# Altium schematic sheet AML166.SchDoc
size A3; CheckedBy: <审核人员>; Author: 刘时杰; DocumentNumber: 7; SheetNumber: 7; SheetTotal: 8; PageSetup: Record=PageOptions|CenterHorizontal=True|CenterVertical=True|PrintScale=1.00|XCorrection=1.00|YCorrection=1.00|PrintKind=0|BorderSize=5000000|LeftOffset=0|BottomOffset=0|Orientation=2|PaperLength=1000|PaperWidth=1000|Scale=100|PaperSource=7|PrintQuality=600|MediaType=1|DitherType=10|PaperKind=A4|PrintScaleMode=1; DesignDate: 20180913; CheckDate: <审核日期>; SheetName: AML166_ADC24; SheetVersion: <图纸版本>; SheetDescription: AML166评估24位ADC性能电路; ProductName: AML166; ProductModel: AML166-Core
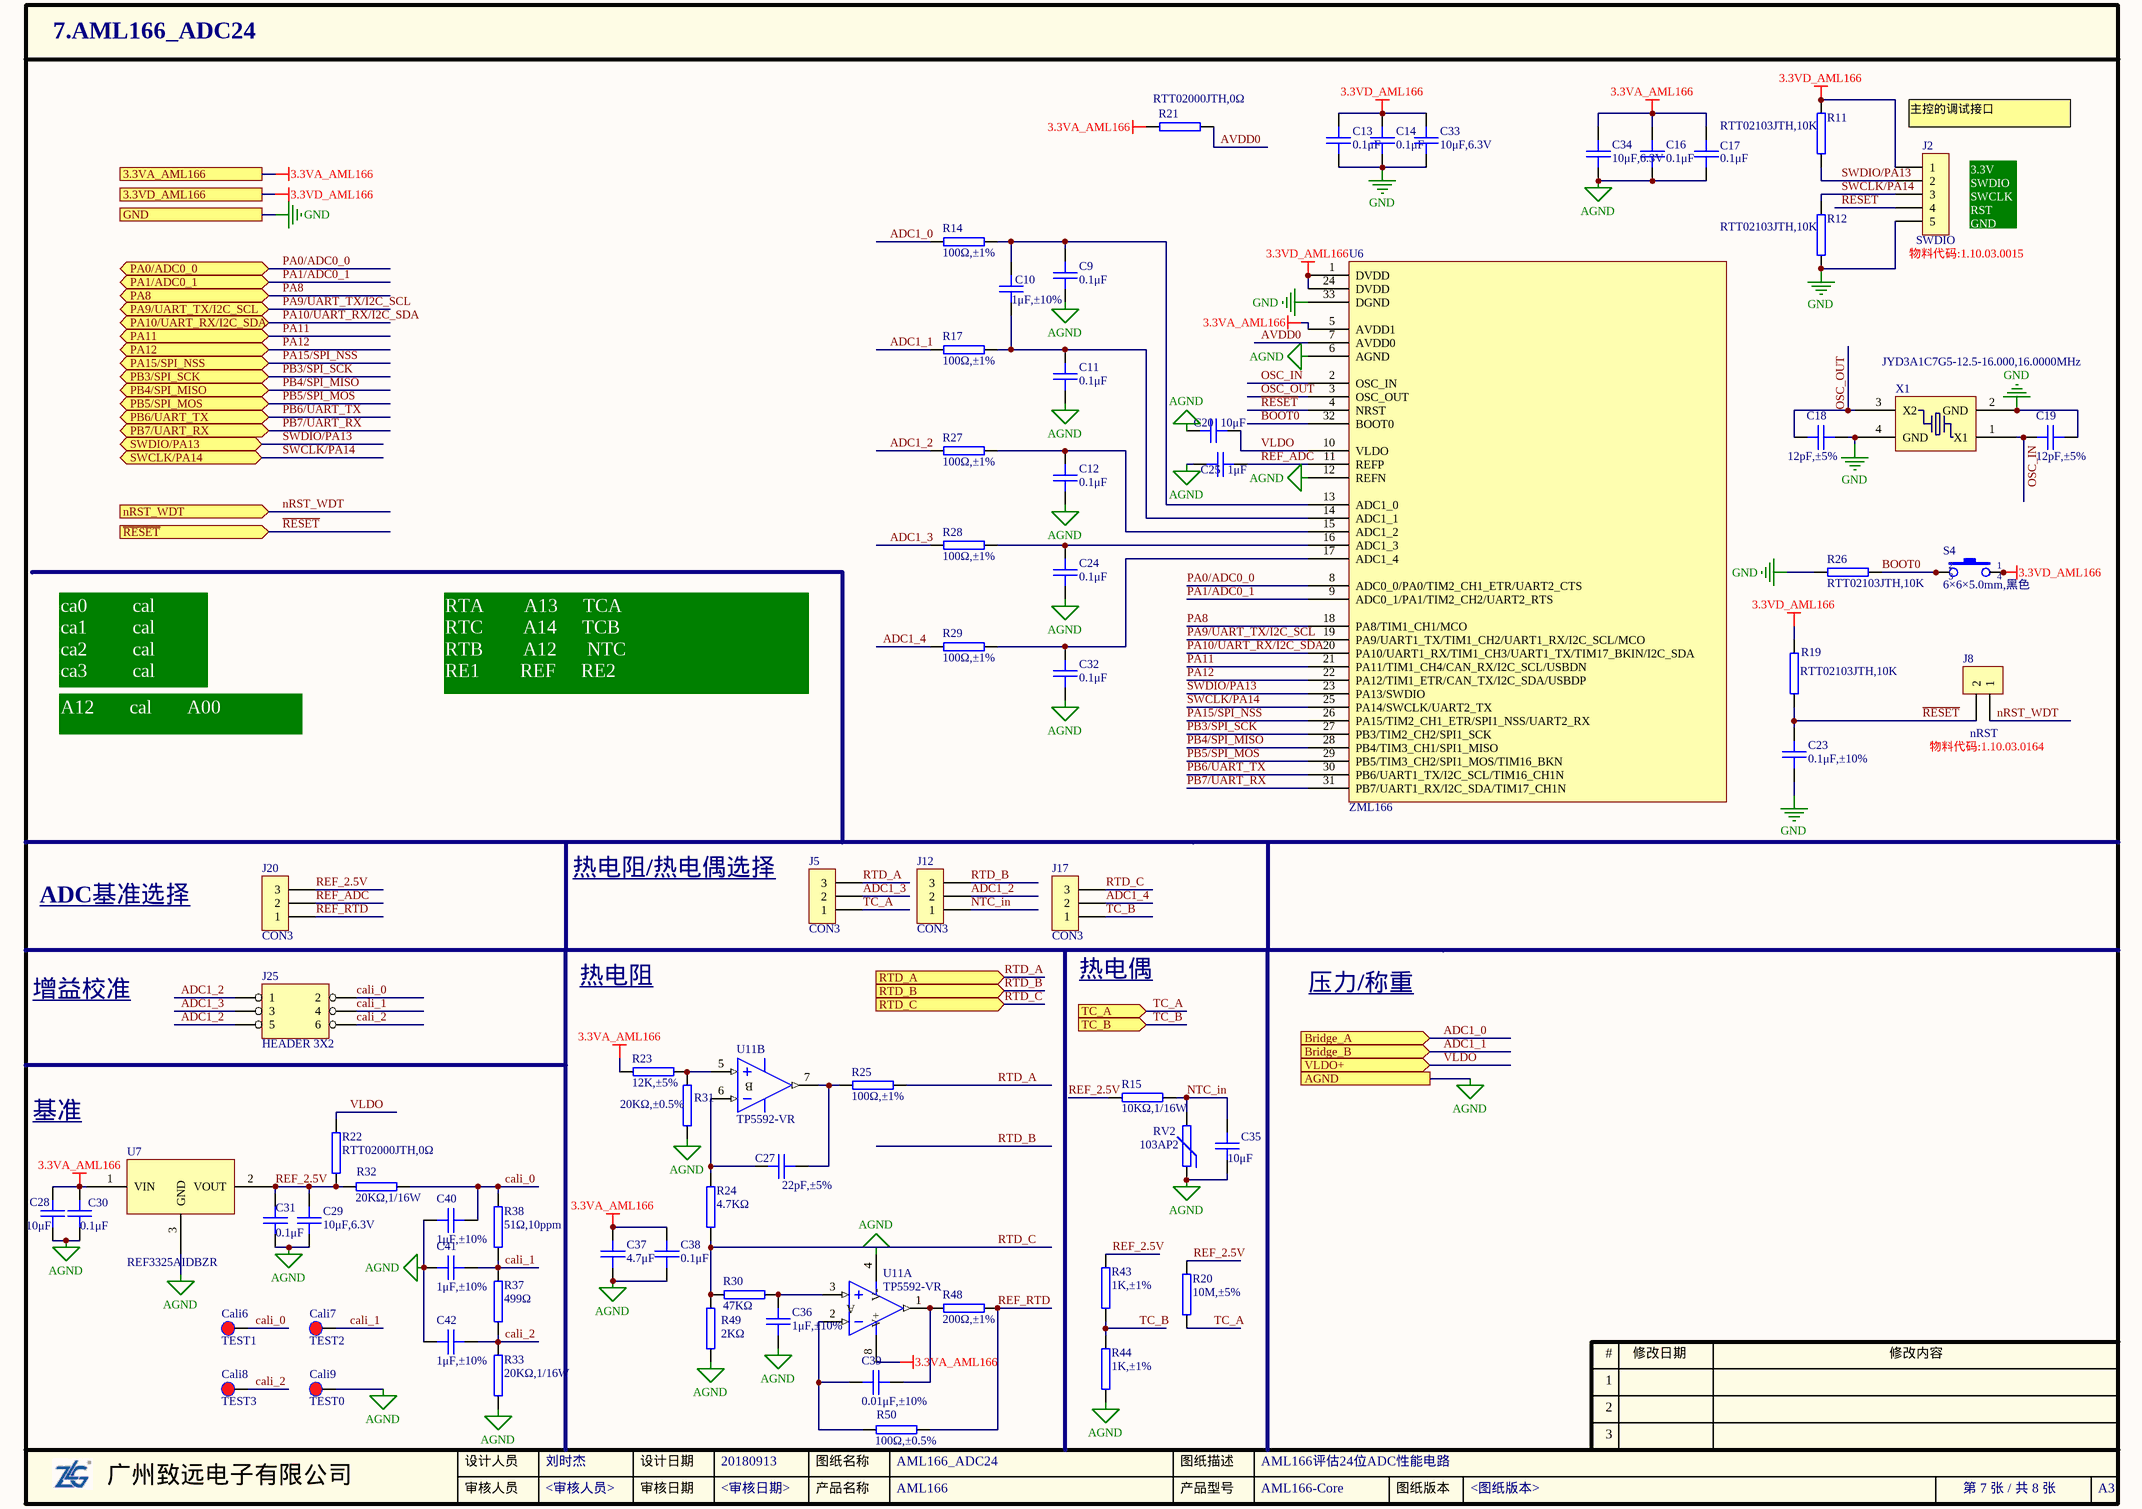
[diagram p0: AML166.SchDoc]

## Parts
C9  0.1μF  [0402C]
C10  1μF,±10%  [0402C]
C11  0.1μF  [0402C]
C12  0.1μF  [0402C]
C13  0.1μF  [0402C]
C14  0.1μF  [0402C]
C16  0.1μF  [0402C]
C17  0.1μF  [0402C]
C18  12pF,±5%  [0402C]
C19  12pF,±5%  [0402C]
C20  10μF  [0603C]
C23  0.1μF,±10%  [0402C]
C24  0.1μF  [0402C]
C25  1μF  [0402C]
C27  22pF,±5%  [0402C]
C28  10μF  [0603C]
C29  10μF,6.3V  [0603C]
C30  0.1μF  [0402C]
C31  0.1μF  [0402C]
C32  0.1μF  [0402C]
C33  10μF,6.3V  [0603C]
C34  10μF,6.3V  [0603C]
C35  10μF  [0603C]
C36  1μF,±10%  [0402C]
C37  4.7μF  [0402C]
C38  0.1μF  [0402C]
C39  0.01μF,±10%  [0402C]
C40  1μF,±10%  [0402C]
C41  1μF,±10%  [0402C]
C42  1μF,±10%  [0402C]
Cali6  TEST1  [PAD-25/40]  (no BOM)
Cali7  TEST2  [PAD-25/40]  (no BOM)
Cali8  TEST3  [PAD-25/40]  (no BOM)
Cali9  TEST0  [PAD-25/40]  (no BOM)
J2  SWDIO  [SIP-5-2.54-6.0-R90]
J5  CON3  [SIP-3-2.54]
J8  nRST  [SIP-2-2.54]
J12  CON3  [SIP-3-2.54]
J17  CON3  [SIP-3-2.54]
J20  CON3  [SIP-3-2.54]
J25  HEADER 3X2  [IDC-6-2.54]
R11  RTT02103JTH,10K  [0402R]
R12  RTT02103JTH,10K  [0402R]
R14  100Ω,±1%  [0402R]
R15  10KΩ,1/16W  [0603R]
R17  100Ω,±1%  [0402R]
R19  RTT02103JTH,10K  [0402R]
R20  10M,±5%  [0402R]
R21  RTT02000JTH,0Ω  [0402R]
R22  RTT02000JTH,0Ω  [0402R]  (no BOM)
R23  12K,±5%  [0402R]
R24  4.7KΩ  [0603R]
R25  100Ω,±1%  [0402R]
R26  RTT02103JTH,10K  [0402R]
R27  100Ω,±1%  [0402R]
R28  100Ω,±1%  [0402R]
R29  100Ω,±1%  [0402R]
R30  47KΩ  [0603R]
R31  20KΩ,±0.5%  [0402R]
R32  20KΩ,1/16W  [0603R]
R33  20KΩ,1/16W  [0603R]
R37  499Ω  [0603R]
R38  51Ω,10ppm  [0603R]
R43  1K,±1%  [0402R]
R44  1K,±1%  [0402R]
R48  200Ω,±1%  [0402R]
R49  2KΩ  [0603R]
R50  100Ω,±0.5%  [0402R]
RV2  103AP2  [RESRR254W35L380T260H850P]
S4  value 6×6×5.0mm,黑色  [KEY-6S]  (hidden comment: SW-PB4P)
U6  ZML166  [QFN50P500X500X85-33N]
U7  REF3325AIDBZR  [SOT-23]
U11  TP5592-VR  [SOP65P490X120-8N]  (parts A,B of 2)
X1  JYD3A1C7G5-12.5-16.000,16.0000MHz  [OSCCC250X320X80-4N]

## Ports
3.3VA_AML166, 3.3VD_AML166, AGND, Bridge_A (in), Bridge_B (in), GND, nRST_WDT (in), PA0/ADC0_0 (bidir), PA1/ADC0_1 (bidir), PA8 (bidir), PA9/UART_TX/I2C_SCL (bidir), PA10/UART_RX/I2C_SDA (bidir), PA11 (bidir), PA12 (bidir), PA15/SPI_NSS (bidir), PB3/SPI_SCK (bidir), PB4/SPI_MISO (bidir), PB5/SPI_MOS (bidir), PB6/UART_TX (bidir), PB7/UART_RX (bidir), RTD_A (in), RTD_B (in), RTD_C (in), SWCLK/PA14 (bidir), SWDIO/PA13 (bidir), TC_A (in), TC_B (in), VLDO+ (in), ~{RESET} (in)

## Nets
3.3VA_AML166: C16.1 C17.1 C28.2 C30.1 C34.2 C37.1 C38.1 R21.1 R23.1 U6.5(AVDD1) U7.1(VIN) U11.8(V+) ; port 3.3VA_AML166
3.3VD_AML166: C13.1 C14.1 C33.2 J2.1 R11.2 R19.1 S4.1 S4.4 U6.1(DVDD) U6.24(DVDD) ; port 3.3VD_AML166
AGND: C9.2 C11.2 C12.2 C16.2 C17.2 C20.2 C24.2 C25.1 C28.1 C29.1 C30.2 C31.2 C32.2 C34.1 C35.1 C36.2 C37.2 C38.2 C40.1 C41.1 C42.1 Cali9.1 R31.1 R33.2 R44.2 R49.1 RV2.1 U6.6(AGND) U6.12(REFN) U7.3(GND) U11.4(V-) ; port AGND
GND: C13.2 C14.2 C18.1 C19.2 C23.2 C33.1 J2.5 R12.1 R26.2 U6.33(DGND) X1.2(GND) X1.4(GND) ; port GND
ADC1_0: R14.1 ; port Bridge_A
ADC1_1: R17.1 ; port Bridge_B
ADC1_2: J12.2 J25.1 J25.5 R27.1
ADC1_3: J5.2 J25.3 R28.1
ADC1_4: J17.2 R29.1
AVDD0: R21.2 U6.7(AVDD0)
BOOT0: R26.1 S4.2 S4.3 U6.32(BOOT0)
cali_0: C40.2 Cali6.1 J25.2 R32.1 R38.1
cali_1: C41.2 Cali7.1 J25.4 R37.2 R38.2
cali_2: C42.2 Cali8.1 J25.6 R33.1 R37.1
nRST_WDT: J8.1 ; port nRST_WDT
NTC_in: C35.2 J12.1 R15.2 RV2.2
OSC_IN: C19.1 U6.2(OSC_IN) X1.1(X1)
OSC_OUT: C18.2 U6.3(OSC_OUT) X1.3(X2)
PA0/ADC0_0: U6.8(ADC0_0/PA0/TIM2_CH1_ETR/UART2_CTS) ; port PA0/ADC0_0
PA1/ADC0_1: U6.9(ADC0_1/PA1/TIM2_CH2/UART2_RTS) ; port PA1/ADC0_1
PA8: U6.18(PA8/TIM1_CH1/MCO) ; port PA8
PA9/UART_TX/I2C_SCL: U6.19(PA9/UART1_TX/TIM1_CH2/UART1_RX/I2C_SCL/MCO) ; port PA9/UART_TX/I2C_SCL
PA10/UART_RX/I2C_SDA: U6.20(PA10/UART1_RX/TIM1_CH3/UART1_TX/TIM17_BKIN/I2C_SDA) ; port PA10/UART_RX/I2C_SDA
PA11: U6.21(PA11/TIM1_CH4/CAN_RX/I2C_SCL/USBDN) ; port PA11
PA12: U6.22(PA12/TIM1_ETR/CAN_TX/I2C_SDA/USBDP) ; port PA12
PA15/SPI_NSS: U6.26(PA15/TIM2_CH1_ETR/SPI1_NSS/UART2_RX) ; port PA15/SPI_NSS
PB3/SPI_SCK: U6.27(PB3/TIM2_CH2/SPI1_SCK) ; port PB3/SPI_SCK
PB4/SPI_MISO: U6.28(PB4/TIM3_CH1/SPI1_MISO) ; port PB4/SPI_MISO
PB5/SPI_MOS: U6.29(PB5/TIM3_CH2/SPI1_MOS/TIM16_BKN) ; port PB5/SPI_MOS
PB6/UART_TX: U6.30(PB6/UART1_TX/I2C_SCL/TIM16_CH1N) ; port PB6/UART_TX
PB7/UART_RX: U6.31(PB7/UART1_RX/I2C_SDA/TIM17_CH1N) ; port PB7/UART_RX
~{RESET}: C23.1 J2.4 J8.2 R19.2 U6.4(NRST) ; port ~{RESET}
REF_2.5V: C29.2 C31.1 J20.3 R15.1 R20.2 R22.1 R32.2 R43.2 U7.2(VOUT)
REF_ADC: C25.2 J20.2 U6.11(REFP)
REF_RTD: J20.1 R48.2 R50.1
RTD_A: J5.3 R25.2 ; port RTD_A
RTD_B: J12.3 ; port RTD_B
RTD_C: J17.3 R24.1 R30.1 R49.2 ; port RTD_C
SWCLK/PA14: J2.3 R12.2 U6.25(PA14/SWCLK/UART2_TX) ; port SWCLK/PA14
SWDIO/PA13: J2.2 R11.1 U6.23(PA13/SWDIO) ; port SWDIO/PA13
TC_A: J5.1 R20.1 ; port TC_A
TC_B: J17.1 R43.1 R44.1 ; port TC_B
VLDO: C20.1 R22.2 U6.10(VLDO) ; port VLDO+
NetC9_1: C9.1 C10.1 R14.2 U6.13(ADC1_0)
NetC10_2: C10.2 C11.1 R17.2 U6.14(ADC1_1)
NetC12_1: C12.1 R27.2 U6.15(ADC1_2)
NetC24_1: C24.1 R28.2 U6.16(ADC1_3)
NetC27_1: C27.1 R24.2 U11.6(IN-)
NetC27_2: C27.2 R25.1 U11.7(OUT)
NetC32_1: C32.1 R29.2 U6.17(ADC1_4)
NetC36_1: C36.1 R30.2 U11.3(IN+)
NetC39_1: C39.1 R50.2 U11.2(IN-)
NetC39_2: C39.2 R48.1 U11.1(OUT)
NetR23_2: R23.2 R31.2 U11.5(IN+)

## Notes on the sheet
- (near J2) 主控的调试接口
- (near J2) 3.3V
  SWDIO
  SWCLK
  RST
  GND
- (near J2) 物料代码:1.10.03.0015
- ca0         cal
  ca1         cal
  ca2         cal
  ca3         cal
- RTA        A13     TCA
  RTC        A14     TCB
  RTB        A12      NTC
  RE1        REF     RE2
- A12       cal       A00
- (near J8) 物料代码:1.10.03.0164
- ADC基准选择
- 热电阻/热电偶选择
- 热电阻
- (near J17) 热电偶
- 压力/称重
- 增益校准
- 基准
- 1
- #
- 修改日期
- 修改内容
- 2
- 3
- 广州致远电子有限公司
- 设计人员
- 审核人员
- 设计日期
- 审核日期
- 产品名称
- 图纸名称
- 产品型号
- 图纸描述
- 图纸版本
- A3
- (in symbol 1.05.20.0102, part A) A
- (in symbol 1.05.20.0102, part B) B

## Library data of the parts
C9 C11-C14 C16 C17 C24 C30-C32 C38 = 1.02.17.0118: GCM155R71E104KE02D,0.1μF,±10%,25V,X7R,0402,muRata,RoHS; 名称: 电容; 封装: 0402; 贴片和直插: SMT; PCB备注: 161012yjh; 器件优选方案: 正常状态，可以选用; 物料代码: 1.02.17.0118; Value: 0.1μF; 厂商: muRata; RoHS: RoHS; 型号: GCM155R71E104KE02D,0.1μF,±10%,25V,X7R; ComponentLink1Description: ErpDataInfo; ComponentLink1URL: http://erp.zlgmcu.com/ErpExt/ErpData/ListMateriel.aspx?pkey=1.02.17.0118
C10 C25 C36 C40-C42 = 1.02.17.0092: GRM155R61C105KA12D,1μF,±10% ,16V,X5R,0402,muRata,RoHS; 名称: 电容; 封装: 0402; 贴片和直插: SMT; PCB备注: 无数据手册，依据采购部提供的信息添加的封装。; 器件优选方案: 正常状态，可以选用; 物料代码: 1.02.17.0092; 厂商: muRata; RoHS: RoHS; 型号: 1μF,±10% ,16V,X5R; ComponentLink1Description: ErpDataInfo; ComponentLink1URL: http://erp.zlgmcu.com/ErpExt/ErpData/ListMateriel.aspx?pkey=1.02.17.0092
  C10 C36 C40-C42: Value: 1μF,±10%
  C25: Value: 1μF
C18 C19 = 1.02.17.0018: GRM1555C1H120JA01D,12pF,±5%,50V,C0G,0402,muRata,RoHS; 名称: 电容; 封装: 0402; 设备封装名称: C0402_12PF_COG_50V_5%; 贴片和直插: SMT; 器件优选方案: 正常状态，可以选用; 物料代码: 1.02.17.0018; Value: 12pF,±5%; 厂商: muRata; RoHS: RoHS; 型号: 12pF,±5%,50V,C0G; ComponentLink1Description: ErpDataInfo; ComponentLink1URL: http://erp.zlgmcu.com/ErpExt/ErpData/ListMateriel.aspx?pkey=1.02.17.0018
C20 C28 C29 C33-C35 = 1.02.01.0065: 10μF,6.3V,X5R,GRM188R60J106M****,0603,Murata,RoHS; 名称: 电容; 封装: 0603; 贴片和直插: SMT; 器件优选方案: 正常状态，可以选用; 物料代码: 1.02.01.0065; 厂商: muRata; RoHS: RoHS; 型号: 10μF,6.3V,X5R,GRM188R60J106M****; ComponentLink1Description: ErpDataInfo; ComponentLink1URL: http://erp.zlgmcu.com/ErpExt/ErpData/ListMateriel.aspx?pkey=1.02.01.0065
  C20 C28 C35: Value: 10μF
  C29 C33 C34: Value: 10μF,6.3V
C23 = 1.02.17.0006: GRM155R71C104KA88D,0.1μF,±10%,16V,X7R,0402,muRata,RoHS; 名称: 电容; 封装: 0402; 设备封装名称: C0402_0.1uF_X7R_16V_10%; 贴片和直插: SMT; 器件优选方案: 正常状态，可以选用; 物料代码: 1.02.17.0006; Value: 0.1μF,±10%; 厂商: muRata; RoHS: RoHS; 型号: 0.1μF,±10%,16V,X7R; ComponentLink1Description: ErpDataInfo; ComponentLink1URL: http://erp.zlgmcu.com/ErpExt/ErpData/ListMateriel.aspx?pkey=1.02.17.0006
C27 = 1.02.17.0036: GRM1555C1H220JA01D,22pF,±5%,50V,C0G,0402,muRata,RoHS; 名称: 电容; 封装: 0402; 设备封装名称: C0402_22PF_NPO_50V_5%; 贴片和直插: SMT; 器件优选方案: 正常状态，可以选用; 物料代码: 1.02.17.0036; Value: 22pF,±5%; 厂商: muRata; RoHS: RoHS; 型号: 22pF,±5%,50V,C0G; ComponentLink1Description: ErpDataInfo; ComponentLink1URL: http://erp.zlgmcu.com/ErpExt/ErpData/ListMateriel.aspx?pkey=1.02.17.0036
C37 = 1.02.17.0073: GRM155R60J475ME87D,4.7μF,±20%,6.3V,X5R,0402,muRata,RoHS; 名称: 电容; 封装: 0402; 贴片和直插: SMT; 器件优选方案: 正常状态，可以选用; 物料代码: 1.02.17.0073; Value: 4.7μF; 厂商: muRata; RoHS: RoHS; 型号: 4.7μF,±20%,6.3V,X5R; ComponentLink1Description: ErpDataInfo; ComponentLink1URL: http://erp.zlgmcu.com/ErpExt/ErpData/ListMateriel.aspx?pkey=1.02.17.0073
C39 = 1.02.17.0019: GRM155R71H103KA88D,0.01μF,±10%,50V,X7R,0402,muRata,RoHS; 名称: 电容; 封装: 0402; 设备封装名称: C0402_0.01uF_X7R_50V_10%; 贴片和直插: SMT; 器件优选方案: 正常状态，可以选用; 物料代码: 1.02.17.0019; Value: 0.01μF,±10%; 厂商: muRata; RoHS: RoHS; 型号: 0.01μF,±10%,50V,X7R; ComponentLink1Description: ErpDataInfo; ComponentLink1URL: http://erp.zlgmcu.com/ErpExt/ErpData/ListMateriel.aspx?pkey=1.02.17.0019
Cali6-Cali9 = TEST-DOT
J2 = CON5: Connector; 物料代码: 1.10.03.0015
J5 J12 J17 J20 = CON3: Connector
J8 = CON2: Connector; 物料代码: 1.10.03.0164
R11 R12 R19 R26 = 1.01.17.0006: RTT02103JTH,10K,±5%,0402,RALEC,RoHS; 名称: 电阻; 封装: 0402; 设备封装名称: R0402_10K; 贴片和直插: SMT; 器件优选方案: 正常状态，可以选用; 物料代码: 1.01.17.0006; Value: RTT02103JTH,10K; 厂商: RALEC; RoHS: RoHS; 型号: RTT02103JTH,10K,±5%; ComponentLink1Description: ErpDataInfo; ComponentLink1URL: http://erp.zlgmcu.com/ErpExt/ErpData/ListMateriel.aspx?pkey=1.01.17.0006
R14 R17 R25 R27-R29 = 1.01.17.0029: 100Ω,±1%,0402,RALEC,RoHS; 名称: 电阻; 封装: 0402; 设备封装名称: R0402_100R_1%; 贴片和直插: SMT; 器件优选方案: 正常状态，可以选用; 物料代码: 1.01.17.0029; Value: 100Ω,±1%; 厂商: Ralec; RoHS: RoHS; 型号: 100Ω,±1%; ComponentLink1Description: ErpDataInfo; ComponentLink1URL: http://erp.zlgmcu.com/ErpExt/ErpData/ListMateriel.aspx?pkey=1.01.17.0029
R15 = 1.01.01.0192: 10KΩ,1/16W,10PPM/℃,±0.1%,0603,Viking,RoHS; 名称: 电阻; 封装: 0603; 设备封装名称: R0603_10K_0.1%; 贴片和直插: SMT; 器件优选方案: 临时/偏门物料/不主推物料，谨慎选用; 物料代码: 1.01.01.0192; Value: 10KΩ,1/16W; 厂商: Viking; RoHS: RoHS; 型号: 10KΩ,1/16W,10PPM/℃,±0.1%; ComponentLink1Description: ErpDataInfo; ComponentLink1URL: http://erp.zlgmcu.com/ErpExt/ErpData/ListMateriel.aspx?pkey=1.01.01.0192
R20 = 1.01.17.0005: 10M,±5%,0402,RALEC,RoHS; 名称: 电阻; 封装: 0402; 设备封装名称: R0402_10M; 贴片和直插: SMT; 器件优选方案: 正常状态，可以选用; 物料代码: 1.01.17.0005; Value: 10M,±5%; 厂商: Ralec; RoHS: RoHS; 型号: 10M,±5%; ComponentLink1Description: ErpDataInfo; ComponentLink1URL: http://erp.zlgmcu.com/ErpExt/ErpData/ListMateriel.aspx?pkey=1.01.17.0005
R21 R22 = 1.01.17.0004: RTT02000JTH,0Ω,±5%,0402,RALEC,RoHS; 名称: 电阻; 封装: 0402; 设备封装名称: R0402_0R; 贴片和直插: SMT; 器件优选方案: 正常状态，可以选用; 物料代码: 1.01.17.0004; Value: RTT02000JTH,0Ω; 厂商: RALEC; RoHS: RoHS; 型号: RTT02000JTH,0Ω,±5%; ComponentLink1Description: ErpDataInfo; ComponentLink1URL: http://erp.zlgmcu.com/ErpExt/ErpData/ListMateriel.aspx?pkey=1.01.17.0004
R23 = 1.01.17.0035: 12K,±5%,0402,RALEC,RoHS; 名称: 电阻; 封装: 0402; 设备封装名称: R0402_12K; 贴片和直插: SMT; 器件优选方案: 正常状态，可以选用; 物料代码: 1.01.17.0035; Value: 12K,±5%; 厂商: Ralec; RoHS: RoHS; 型号: 12K,±5%; ComponentLink1Description: ErpDataInfo; ComponentLink1URL: http://erp.zlgmcu.com/ErpExt/ErpData/ListMateriel.aspx?pkey=1.01.17.0035
R24 = 1.01.01.0045: 4.7KΩ,0603,*,RoHS; 名称: 电阻; 封装: 0603; 设备封装名称: R0603_4.7K; 厂商: Ralec; 贴片和直插: SMT; 器件优选方案: 正常状态，可以选用; 物料代码: 1.01.01.0045; Value: 4.7KΩ; RoHS: RoHS; 型号: 4.7KΩ; ComponentLink1Description: ErpDataInfo; ComponentLink1URL: http://erp.zlgmcu.com/ErpExt/ErpData/ListMateriel.aspx?pkey=1.01.01.0045
R30 = 1.01.01.0060: 47KΩ,0603,*,RoHS; 名称: 电阻; 封装: 0603; 设备封装名称: R0603_47K; 厂商: Ralec; 贴片和直插: SMT; 器件优选方案: 正常状态，可以选用; 物料代码: 1.01.01.0060; Value: 47KΩ; RoHS: RoHS; 型号: 47KΩ; ComponentLink1Description: ErpDataInfo; ComponentLink1URL: http://erp.zlgmcu.com/ErpExt/ErpData/ListMateriel.aspx?pkey=1.01.01.0060
R31 = 1.01.17.0053: 20KΩ,±0.5%,0402,RoHS; 名称: 电阻; 封装: 0402; 设备封装名称: R0402_20K_0.5%; 厂商: Ralec; 贴片和直插: SMT; 器件优选方案: 正常状态，可以选用; 物料代码: 1.01.17.0053; Value: 20KΩ,±0.5%; RoHS: RoHS; 型号: 20KΩ,±0.5%; ComponentLink1Description: ErpDataInfo; ComponentLink1URL: http://erp.zlgmcu.com/ErpExt/ErpData/ListMateriel.aspx?pkey=1.01.17.0053
R32 R33 = 1.01.01.0207: 20KΩ,1/16W,10PPM/℃,±0.1%,0603,Viking,RoHS; 名称: 电阻; 封装: 0603; 贴片和直插: SMT; 器件优选方案: 临时/偏门物料/不主推物料，谨慎选用; 物料代码: 1.01.01.0207; Value: 20KΩ,1/16W; 厂商: Viking; RoHS: RoHS; 型号: 20KΩ,1/16W,10PPM/℃,±0.1%; ComponentLink1Description: ErpDataInfo; ComponentLink1URL: http://erp.zlgmcu.com/ErpExt/ErpData/ListMateriel.aspx?pkey=1.01.01.0207
R37 = 1.01.01.0155: 499Ω,RN731JTTD,4990B10,0603,KOA,RoHS; 名称: 电阻; 封装: 0603; 设备封装名称: R0603_499R_0.1%; 贴片和直插: SMT; 器件优选方案: 临时/偏门物料/不主推物料，谨慎选用; 物料代码: 1.01.01.0155; Value: 499Ω; 厂商: KOA; RoHS: RoHS; 型号: 499Ω,RN731JTTD,4990B10; ComponentLink1Description: ErpDataInfo; ComponentLink1URL: http://erp.zlgmcu.com/ErpExt/ErpData/ListMateriel.aspx?pkey=1.01.01.0155
R38 = 1.01.01.0215: 51Ω,10ppm,±0.1%,AR03BTB0510,0603,Viking,RoHS; 名称: 电阻; 封装: 0603; 贴片和直插: SMT; 器件优选方案: 临时/偏门物料/不主推物料，谨慎选用; 物料代码: 1.01.01.0215; Value: 51Ω,10ppm; 厂商: Viking; RoHS: RoHS; 型号: 51Ω,10ppm,±0.1%,AR03BTB0510; ComponentLink1Description: ErpDataInfo; ComponentLink1URL: http://erp.zlgmcu.com/ErpExt/ErpData/ListMateriel.aspx?pkey=1.01.01.0215
R43 R44 = 1.01.17.0016: 1K,±1%,0402,RALEC,RoHS; 名称: 电阻; 封装: 0402; 设备封装名称: R0402_1K_1%; 贴片和直插: SMT; 器件优选方案: 正常状态，可以选用; 物料代码: 1.01.17.0016; Value: 1K,±1%; 厂商: Ralec; RoHS: RoHS; 型号: 1K,±1%; ComponentLink1Description: ErpDataInfo; ComponentLink1URL: http://erp.zlgmcu.com/ErpExt/ErpData/ListMateriel.aspx?pkey=1.01.17.0016
R48 = 1.01.17.0073: 200Ω,±1%,0402,RoHS; 名称: 电阻; 封装: 0402; 设备封装名称: R0402_200R_1%; 厂商: Ralec; 贴片和直插: SMT; 器件优选方案: 正常状态，可以选用; 物料代码: 1.01.17.0073; Value: 200Ω,±1%; RoHS: RoHS; 型号: 200Ω,±1%; ComponentLink1Description: ErpDataInfo; ComponentLink1URL: http://erp.zlgmcu.com/ErpExt/ErpData/ListMateriel.aspx?pkey=1.01.17.0073
R49 = 1.01.01.0157: 2KΩ,RN731JTTD,2001B10,0603,KOA,RoHS; 名称: 电阻; 封装: 0603; 设备封装名称: R0603_2K_0.1%; 贴片和直插: SMT; 器件优选方案: 临时/偏门物料/不主推物料，谨慎选用; 物料代码: 1.01.01.0157; Value: 2KΩ; 厂商: KOA; RoHS: RoHS; 型号: 2KΩ,RN731JTTD,2001B10; ComponentLink1Description: ErpDataInfo; ComponentLink1URL: http://erp.zlgmcu.com/ErpExt/ErpData/ListMateriel.aspx?pkey=1.01.01.0157
R50 = 1.01.17.0052: 100Ω,±0.5%,0402,RoHS; 名称: 电阻; 封装: 0402; 设备封装名称: R0402_100R_0.5%; 厂商: Ralec; 贴片和直插: SMT; 器件优选方案: 正常状态，可以选用; 物料代码: 1.01.17.0052; Value: 100Ω,±0.5%; RoHS: RoHS; 型号: 100Ω,±0.5%; ComponentLink1Description: ErpDataInfo; ComponentLink1URL: http://erp.zlgmcu.com/ErpExt/ErpData/ListMateriel.aspx?pkey=1.01.17.0052
RV2 = 1.01.14.0020: 103AP2,SIP,semitec,RoHS; 名称: 热敏电阻(临时); 贴片和直插: THT; PCB备注: 171205CZY; 器件优选方案: 临时/偏门物料/不主推物料，谨慎选用; 物料代码: 1.01.14.0020; Value: 103AP2; 封装: SIP; 厂商: semitec; RoHS: RoHS; 型号: 103AP2; ComponentLink1Description: ErpDataInfo; ComponentLink1URL: http://erp.zlgmcu.com/ErpExt/ErpData/ListMateriel.aspx?pkey=1.01.14.0020
S4 = 1.09.01.0003: 6×6×5.0mm,黑色,SMD,,*; 名称: 轻触按键; 贴片和直插: SMT; 物料代码: 1.09.01.0003; 型号: 6×6×5.0mm,黑色,SMD; ComponentLink1Description: ErpDataInfo; ComponentLink1URL: http://erp.zlgmcu.com/ErpExt/ErpData/ListMateriel.aspx?pkey=1.09.01.0003
U7 = 1.05.10.0334: REF3325AIDBZR,SOT-23,TI; 名称: 集成电路; 设备封装名称: SOT-23_REF3325AIDBZR; 贴片和直插: SMT; 器件优选方案: 量产物料,优先选用; 物料代码: 1.05.10.0334; Value: REF3325AIDBZR; 封装: SOT-23; 厂商: TI; 型号: REF3325AIDBZR; ComponentLink1Description: ErpDataInfo; ComponentLink1URL: http://erp.zlgmcu.com/ErpExt/ErpData/ListMateriel.aspx?pkey=1.05.10.0334
U11 = 1.05.20.0102: TP5592-VR,MSOP-8,3PEAK,RoHS; 名称: 集成电路(临时); 贴片和直插: SMT; PCB备注: 170810lmd; 器件优选方案: 临时/偏门物料/不主推物料，谨慎选用; 物料代码: 1.05.20.0102; Value: TP5592-VR; 封装: MSOP-8; 厂商: 3PEAK; RoHS: RoHS; 型号: TP5592-VR; ComponentLink1Description: ErpDataInfo; ComponentLink1URL: http://erp.zlgmcu.com/ErpExt/ErpData/ListMateriel.aspx?pkey=1.05.20.0102
X1 = 1.07.03.0077: JYD3A1C7G5-12.5-16.000,16.0000MHz,±10ppm,12.5pF,-40~85℃,SMD3225,JYEG,RoHS; 名称: 晶体; 贴片和直插: SMT; PCB备注: 151225lmd171128ZW; 器件优选方案: 正常状态，可以选用; 物料代码: 1.07.03.0077; Value: JYD3A1C7G5-12.5-16.000,16.0000MHz; 封装: SMD3225; 厂商: JYEG; RoHS: RoHS; 型号: JYD3A1C7G5-12.5-16.000,16.0000MHz,±10ppm,12.5pF,-40~85℃; ComponentLink1Description: ErpDataInfo; ComponentLink1URL: http://erp.zlgmcu.com/ErpExt/ErpData/ListMateriel.aspx?pkey=1.07.03.0077